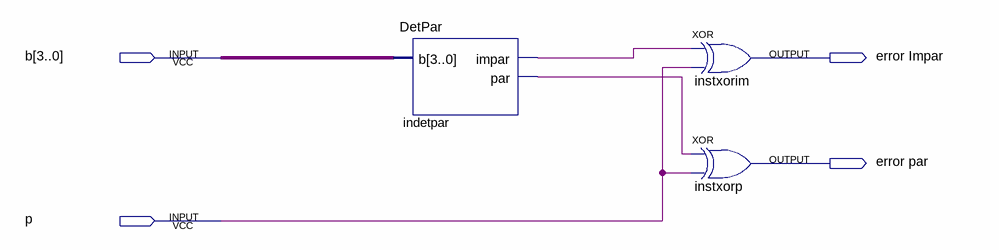
[diagram p0: schematic sheet]
// Quartus schematic DetPar.bdf as structural Verilog: 3 symbols, 4 pins
module DetPar (
  input  [3:0] b,
  input  p,
  output \error_Impar ,
  output \error_par 
);

  wire indetpar_impar, indetpar_par;

  DetPar indetpar (.b(b), .impar(indetpar_impar), .par(indetpar_par));
  xor instxorim (\error_Impar , indetpar_impar, p);
  xor instxorp (\error_par , indetpar_par, p);
endmodule
